# Altium project FelineFeast.PrjPcb (part 1 of 2)
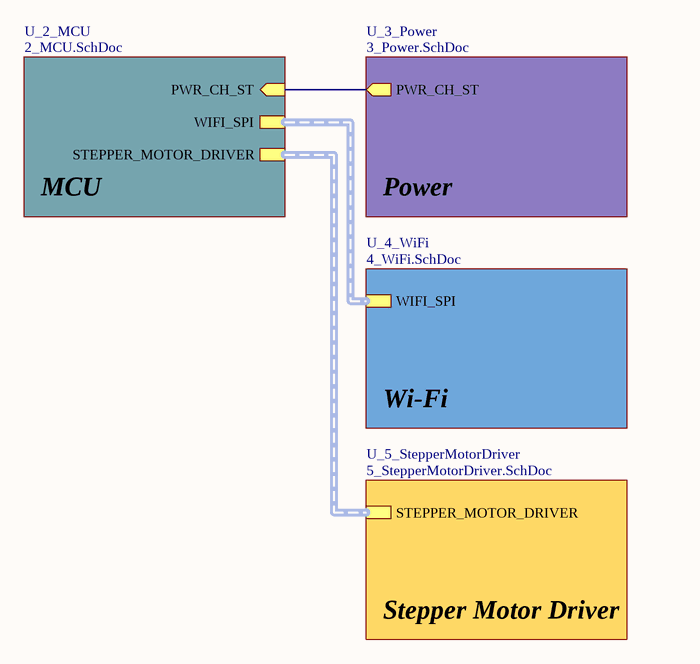
[diagram p0: 1_Overview.SchDoc]
5 sheets, 83 parts. Net scope: hierarchical (ports join the sheet entries above them; power ports are global).
Board file: FelineFeastPCB.PcbDoc
Sheets:
  1_Overview.SchDoc
    U_3_Power = 3_Power.SchDoc
    U_2_MCU = 2_MCU.SchDoc
    U_4_WiFi = 4_WiFi.SchDoc
    U_5_StepperMotorDriver = 5_StepperMotorDriver.SchDoc

## Sheet 1_Overview.SchDoc: Overview
size A4; DrawnBy: Denis Cooper; Organization: felinefeast.org; Revision: 1.0; SheetNumber: 1; SheetTotal: 5

### Sub-sheets
U_2_MCU = 2_MCU.SchDoc: WIFI_SPI (harness WIFI_SPI), PWR_CH_ST (in), STEPPER_MOTOR_DRIVER (harness STEPPER_MOTOR_DRIVER)
U_3_Power = 3_Power.SchDoc: PWR_CH_ST (out)
U_4_WiFi = 4_WiFi.SchDoc: WIFI_SPI (harness WIFI_SPI)
U_5_StepperMotorDriver = 5_StepperMotorDriver.SchDoc: STEPPER_MOTOR_DRIVER (harness STEPPER_MOTOR_DRIVER)

### Nets
NetIC200_18: sheet U_3_Power/PWR_CH_ST, sheet U_2_MCU/PWR_CH_ST

### Buses and harness runs
harness sheet U_2_MCU/STEPPER_MOTOR_DRIVER = sheet U_5_StepperMotorDriver/STEPPER_MOTOR_DRIVER
harness sheet U_2_MCU/WIFI_SPI = sheet U_4_WiFi/WIFI_SPI

### Notes on the sheet
- MCU
- Power
- Wi-Fi
- Stepper Motor Driver

## Sheet 3_Power.SchDoc: 24/5/3.3V Power
size A4; DrawnBy: Denis Cooper; Organization: felinefeast.org; Revision: 1.0; SheetNumber: 3; SheetTotal: 5
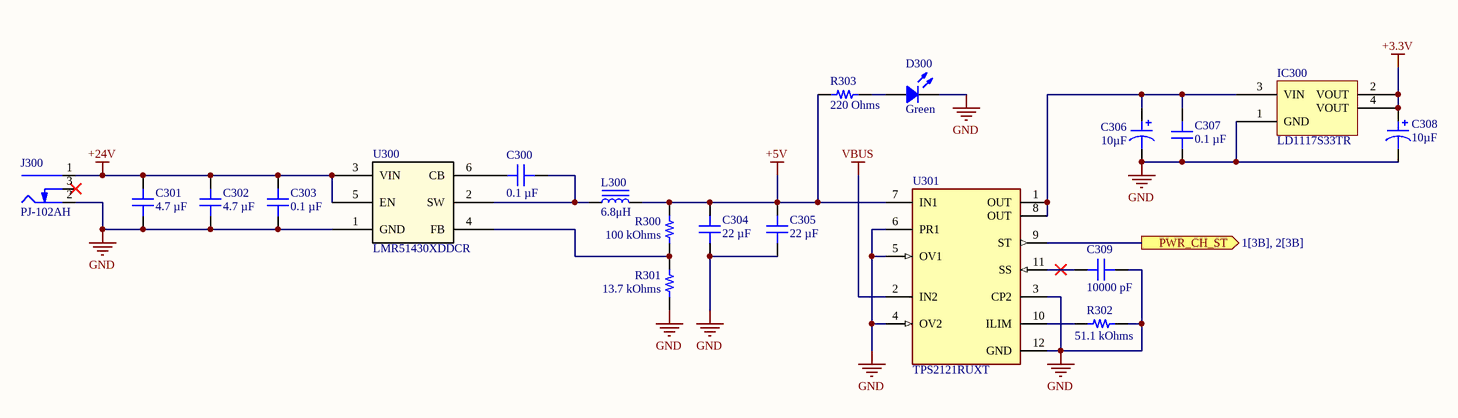
[diagram p1: 3_Power.SchDoc]

### Parts
C300  0.1 µF  [CAP 0603_1608]
C301  4.7 µF  [CAP 1206_3216 - 0.8MM]
C302  4.7 µF  [CAP 1206_3216 - 0.8MM]
C303  0.1 µF  [CAP 0603_1608]
C304  22 µF  [CAP 1210_3225 - 1MM]
C305  22 µF  [CAP 1210_3225 - 1MM]
C306  10µF  [CAP POL 1206_3216]
C307  0.1 µF  [CAP 0603_1608]
C308  10µF  [CAP POL 1206_3216]
C309  10000 pF  [CAP 0603_1608]
D300  Green  [LED 0603_1608 GREEN]
IC300  LD1117S33TR  [ST SOT-223]
J300  PJ-102AH  [CUI PJ-102AH]
L300  Inductance: 6.8μH  [SL0624-6R8M]  (hidden comment: SL0624-6R8M)
R300  100 kOhms  [RES 0603_1608]
R301  13.7 kOhms  [RES 0603_1608]
R302  51.1 kOhms  [RES 0603_1608]
R303  220 Ohms  [RES 0603_1608]
U300  LMR51430XDDCR  [SOT-23-THIN-6_DDC_TEX]
U301  TPS2121RUXT  [FP-RUX0012A-MFG]

### Ports
PWR_CH_ST (out, see 1[3B], 2[3B])

### Nets
+3.3V: C308.1 IC300.2(VOUT) IC300.4(VOUT)
+5V: C304.2 C305.2 L300.2 R300.2 R303.2 U301.7(IN1)
+24V: C301.2 C302.2 C303.2 J300.1(Centre) U300.3(VIN) U300.5(EN)
GND: C301.1 C302.1 C303.1 C304.1 C305.1 C306.2 C307.1 C308.2 C309.1 D300.2 IC300.1(GND) J300.2(Outer) R301.1 R302.1 U300.1(GND) U301.3(CP2) U301.4(OV2) U301.5(OV1) U301.6(PR1) U301.12(GND)
VBUS: U301.2(IN2)
NetC300_1: C300.1 L300.1 U300.2(SW)
NetC300_2: C300.2 U300.6(CB)
NetC306_1: C306.1 C307.2 IC300.3(VIN) U301.1(OUT) U301.8(OUT)
NetC309_2: C309.2 U301.11(SS)
NetD300_1: D300.1 R303.1
NetIC200_18: U301.9(ST) ; port PWR_CH_ST
NetR300_1: R300.1 R301.2 U300.4(FB)
NetR302_2: R302.2 U301.10(ILIM)

Not connected (* = marked no-connect by the designer): J300 3(SW)*

### Library data of the parts
C300 C307 = CL10B104KA8NNNC: CAP CER 0.1UF 25V X7R 0603; manufacturer: Samsung Electro-Mechanics; Tolerance: ±10%; Part Number: CL10B104KA8NNNC; Capacitance: 0.1 µF; Applications: General Purpose; componentlink1description: Datasheet; componentlink1url: http://www.samsungsem.com/kr/support/product-search/mlcc/CL10B104KA8NNNC.jsp; componentlink2description: DigiKey Link; componentlink2url: https://www.digikey.com/en/products/detail/samsung-electro-mechanics/CL10B104KA8NNNC/3886664; Device Package: 0603 (1608 Metric); lastupdated: 09.02.2024 20:10:20; Lifecycle Status: Active; Minimum Order: 1; Mounting Type: Surface Mount, MLCC; Operating Temperature: -55°C ~ 125°C; Package / Case: 0603 (1608 Metric); packaging: TapeAndReel; partid: 9793; Part Status: Active; price: 0.01; series: CL; Size / Dimension: 0.063" L x 0.031" W (1.60mm x 0.80mm); Supplier 1: DigiKey; Supplier Part Number 1: 1276-1006-1-ND; Temperature Coefficient: X7R; Thickness (Max): 0.035" (0.90mm); value: 0.1 µF; Voltage - Rated: 25V
C301 C302 = CL31B475KBHNNNE: CAP CER 4.7UF 50V X7R 1206; manufacturer: Samsung Electro-Mechanics; Tolerance: ±10%; Part Number: CL31B475KBHNNNE; Capacitance: 4.7 µF; Applications: General Purpose; componentlink1description: Datasheet; componentlink1url: http://www.samsungsem.com/kr/support/product-search/mlcc/CL31B475KBHNNNE.jsp; componentlink2description: DigiKey Link; componentlink2url: https://www.digikey.com/en/products/detail/samsung-electro-mechanics/CL31B475KBHNNNE/3888447; Device Package: 1206 (3216 Metric); lastupdated: 04.06.2024 19:10:40; Lifecycle Status: Active; Minimum Order: 1; Mounting Type: Surface Mount, MLCC; Operating Temperature: -55°C ~ 125°C; Package / Case: 1206 (3216 Metric); packaging: TapeAndReel; partid: 40975; Part Status: Active; price: 0.05; series: CL; Size / Dimension: 0.126" L x 0.063" W (3.20mm x 1.60mm); Supplier 1: DigiKey; Supplier Part Number 1: 1276-2789-1-ND; Temperature Coefficient: X7R; Thickness (Max): 0.071" (1.80mm); value: 4.7 µF; Voltage - Rated: 50V
C303 = CL10B104KB8NNNC: CAP CER 0.1UF 50V X7R 0603; manufacturer: Samsung Electro-Mechanics; Tolerance: ±10%; Part Number: CL10B104KB8NNNC; Capacitance: 0.1 µF; Applications: General Purpose; componentlink1description: Datasheet; componentlink1url: http://www.samsungsem.com/kr/support/product-search/mlcc/CL10B104KB8NNNC.jsp; componentlink2description: DigiKey Link; componentlink2url: https://www.digikey.com/en/products/detail/samsung-electro-mechanics/CL10B104KB8NNNC/3886658; Device Package: 0603 (1608 Metric); lastupdated: 09.02.2024 20:10:20; Lifecycle Status: Active; Minimum Order: 1; Mounting Type: Surface Mount, MLCC; Operating Temperature: -55°C ~ 125°C; Package / Case: 0603 (1608 Metric); packaging: TapeAndReel; partid: 9788; Part Status: Active; price: 0.01; series: CL; Size / Dimension: 0.063" L x 0.031" W (1.60mm x 0.80mm); Supplier 1: DigiKey; Supplier Part Number 1: 1276-1000-1-ND; Temperature Coefficient: X7R; Thickness (Max): 0.035" (0.90mm); value: 0.1 µF; Voltage - Rated: 50V
C304 C305 = CL32B226KAJNNNE: CAP CER 22UF 25V X7R 1210; manufacturer: Samsung Electro-Mechanics; Tolerance: ±10%; Part Number: CL32B226KAJNNNE; Value: 22 µF; Applications: General Purpose; Capacitance: 22 µF; componentlink1description: Datasheet; componentlink1url: http://www.samsungsem.com/kr/support/product-search/mlcc/CL32B226KAJNNNE.jsp; componentlink2description: DigiKey Link; componentlink2url: https://www.digikey.com/en/products/detail/samsung-electro-mechanics/CL32B226KAJNNNE/3889050; Device Package: 1210 (3225 Metric); lastupdated: 04.06.2024 19:21:03; Lifecycle Status: Active; Minimum Order: 1; Mounting Type: Surface Mount, MLCC; Operating Temperature: -55°C ~ 125°C; Package / Case: 1210 (3225 Metric); packaging: TapeAndReel; partid: 39957; Part Status: Active; price: 0.13; series: CL; Size / Dimension: 0.126" L x 0.098" W (3.20mm x 2.50mm); Supplier 1: DigiKey; Supplier Part Number 1: 1276-3392-1-ND; Temperature Coefficient: X7R; Thickness (Max): 0.106" (2.70mm); Voltage - Rated: 25V
C306 C308 = TAJA106K016RNJ: CAP TANT 10UF 10% 16V 1206; manufacturer: AVX Corporation; Manufacturer Size Code: A; ESR (Equivalent Series Resistance): 3Ohm; Type: Molded; Part Number: TAJA106K016RNJ; Value: 10µF; Capacitance: 10µF; componentlink1description: Datasheet; componentlink1url: http://datasheets.avx.com/TAJ.pdf; componentlink2description: DigiKey Link; componentlink2url: http://digikey.com/product-detail/en/avx-corporation/TAJA106K016RNJ/478-1655-1-ND/564687; Device Package: 1206 (3216 Metric); Features: General Purpose; Height - Seated (Max): 0.071" (1.80mm); lastupdated: 02.09.2020 1:15:58; Lifecycle Status: Active; Minimum Order: 1; Mounting Type: Surface Mount; Operating Temperature: -55°C ~ 125°C; Package / Case: 1206 (3216 Metric); packaging: TapeAndReel; partid: 412; Part Status: Active; price: 0.10; series: TAJ; Size / Dimension: 0.126" L x 0.063" W (3.20mm x 1.60mm); Supplier 1: DigiKey; Supplier Part Number 1: 478-1655-1-ND; Tolerance: ±10%; Voltage - Rated: 16V
C309 = CL10B103KB8NNNC: CAP CER 10000PF 50V X7R 0603; manufacturer: Samsung Electro-Mechanics; Tolerance: ±10%; Part Number: CL10B103KB8NNNC; Capacitance: 10000 pF; Applications: General Purpose; componentlink1description: Datasheet; componentlink1url: http://www.samsungsem.com/kr/support/product-search/mlcc/CL10B103KB8NNNC.jsp; componentlink2description: DigiKey Link; componentlink2url: https://www.digikey.com/en/products/detail/samsung-electro-mechanics/CL10B103KB8NNNC/3886667; Device Package: 0603 (1608 Metric); lastupdated: 09.02.2024 20:10:26; Lifecycle Status: Active; Minimum Order: 1; Mounting Type: Surface Mount, MLCC; Operating Temperature: -55°C ~ 125°C; Package / Case: 0603 (1608 Metric); packaging: TapeAndReel; partid: 5498; Part Status: Active; price: 0.01; series: CL; Size / Dimension: 0.063" L x 0.031" W (1.60mm x 0.80mm); Supplier 1: DigiKey; Supplier Part Number 1: 1276-1009-1-ND; Temperature Coefficient: X7R; Thickness (Max): 0.035" (0.90mm); value: 10000 pF; Voltage - Rated: 50V
D300 = APT1608CGCK: LED GREEN CLEAR CHIP SMD; Manufacturer: Kingbright; Configuration: Standard; Current - Test: 20mA; Lens Color: Colorless; Lens Size: 1.20mm x 0.80mm; Lens Style: Rectangle with Flat Top; Millicandela Rating: 50mcd; Viewing Angle: 120°; Voltage - Forward (Vf) (Typ): 2.1V; Wavelength - Dominant: 570nm; Wavelength - Peak: 574nm; Part Number: APT1608CGCK; Color: Green; ComponentLink1Description: Datasheet; ComponentLink1URL: http://www.kingbrightusa.com/images/catalog/SPEC/APT1608CGCK.pdf; ComponentLink2Description: DigiKey Link; ComponentLink2URL: https://www.digikey.com/en/products/detail/kingbright/APT1608CGCK/1747514; Device Package: 0603 (1608 Metric); Height (Max): 0.75mm; LastUpdated: 25.08.2025 20:35:24; Lens Transparency: Clear; Lifecycle Status: Active; Minimum Order: 1; Mounting Type: Surface Mount; Package / Case: 0603 (1608 Metric); Packaging: TapeAndReel; PartId: 664; Part Status: Active; Price: 0.05; Series: -; Size / Dimension: 1.60mm L x 0.80mm W; Supplier 1: DigiKey; Supplier Part Number 1: 754-1116-1-ND; Supplier Device Package: Chip LED; Value: Green
IC300 = LD1117S33TR: IC REG LINEAR 3.3V 800MA SOT223; Manufacturer: STMicroelectronics; Current - Quiescent (Iq): 10 mA; Number of Regulators: 1; Output Configuration: Positive; Output Type: Fixed; Protection Features: Over Current, Over Temperature; PSRR: 75dB (120Hz); Voltage Dropout (Max): 1.2V @ 800mA; Voltage - Input (Max): 15V; Part Number: LD1117S33TR; ComponentLink1Description: Datasheet; ComponentLink1URL: http://www.st.com/content/ccc/resource/technical/document/datasheet/99/3b/7d/91/91/51/4b/be/CD00000544.pdf/files/CD00000544.pdf/jcr:content/translations/en.CD00000544.pdf; ComponentLink2Description: DigiKey Link; ComponentLink2URL: https://www.digikey.com/en/products/detail/stmicroelectronics/LD1117S33TR/585766; Current - Output: 800mA; LastUpdated: 03.06.2024 20:14:20; Lifecycle Status: Active; Minimum Order: 1; Mounting Type: Surface Mount; Operating Temperature: 0°C ~ 125°C; Package / Case: TO-261-4, TO-261AA; Packaging: TapeAndReel; Part Status: Active; Price: 0.13; Series: -; Supplier 1: DigiKey; Supplier Part Number 1: 497-1242-1-ND; Supplier Device Package: SOT-223; Voltage - Output (Min/Fixed): 3.3V
J300 = PJ-102AH: CONN PWR JACK 2X5.5MM SOLDER; Manufacturer: CUI Devices; Actual Diameter: 0.079" (2.00mm ID), 0.256" (6.50mm OD); Current Rating (Amps): 5A; Gender: Male; Industry Recognized Mating Diameter: 2.00mm ID (0.079"), 5.50mm OD (0.217"); Internal Switch(s): Single Switch, Normally Closed; Material Flammability Rating: UL94 V-0; Mating Length/Depth: 0.354" (9.00mm); Number of Positions/Contacts: 2 Conductors, 3 Contacts; Shielding: Unshielded; Voltage - Rated: 24VDC; Part Number: PJ-102AH; ComponentLink1Description: Datasheet; ComponentLink1URL: https://www.cuidevices.com/product/resource/digikeypdf/pj-102ah.pdf; ComponentLink2Description: DigiKey Link; ComponentLink2URL: //digikey.com/product-detail/en/cui-devices/PJ-102AH/CP-102AH-ND/408448; Connector Type: Jack; LastUpdated: 16.12.2019 19:01:27; Lifecycle Status: 0; Minimum Order: 1; Mounting Type: Through Hole, Right Angle; Packaging: Tray; Part Status: Active; Price: 0.76; Series: -; Supplier 1: DigiKey; Supplier Part Number 1: CP-102AH-ND; Termination: Solder
L300 = SL0624-6R8M: 4A 5A 6.8uH 70mΩ ±20% SMD,7.1x6.6mm Inductors (SMD) ROHS; Manufacturer: TECHFUSE; Package: SMD,7.1x6.6mm; Current - Saturation (Isat): 5A; Tolerance: ±20%; Current Rating: 4A; DC Resistance (DCR): 70mΩ
R300 = ERJ-3EKF1003V: RES SMD 100K OHM 1% 1/10W 0603; Manufacturer: Panasonic Electronic Components; Power (Watts): 0.1W, 1/10W; Temperature Coefficient: ±100ppm/°C; Part Number: ERJ-3EKF1003V; Value: 100 kOhms; ComponentLink1Description: Datasheet; ComponentLink1URL: https://industrial.panasonic.com/cdbs/www-data/pdf/RDA0000/AOA0000C304.pdf; ComponentLink2Description: DigiKey Link; ComponentLink2URL: https://www.digikey.com/en/products/detail/panasonic-electronic-components/ERJ-3EKF1003V/196075; Composition: Thick Film; Device Package: 0603 (1608 Metric); Features: Automotive AEC-Q200; Height - Seated (Max): 0.022" (0.55mm); LastUpdated: 09.02.2024 20:41:59; Lifecycle Status: Active; Minimum Order: 1; Number of Terminations: 2; Operating Temperature: -55°C ~ 155°C; Package / Case: 0603 (1608 Metric); Packaging: TapeAndReel; PartId: 25699; Part Status: Active; Price: 0.01; Ratings: AEC-Q200; Resistance: 100 kOhms; Series: ERJ-3EK; Size / Dimension: 0.063" L x 0.031" W (1.60mm x 0.80mm); Supplier 1: DigiKey; Supplier Part Number 1: P100KHCT-ND; Supplier Device Package: 0603; Tolerance: ±1%
R301 = ERJ-3EKF1372V: RES SMD 13.7K OHM 1% 1/10W 0603; Manufacturer: Panasonic Electronic Components; Power (Watts): 0.1W, 1/10W; Temperature Coefficient: ±100ppm/°C; Part Number: ERJ-3EKF1372V; Value: 13.7 kOhms; ComponentLink1Description: Datasheet; ComponentLink1URL: https://industrial.panasonic.com/cdbs/www-data/pdf/RDA0000/AOA0000C304.pdf; ComponentLink2Description: DigiKey Link; ComponentLink2URL: https://www.digikey.com/en/products/detail/panasonic-electronic-components/ERJ-3EKF1372V/196114; Composition: Thick Film; Device Package: 0603 (1608 Metric); Features: Automotive AEC-Q200; Height - Seated (Max): 0.022" (0.55mm); LastUpdated: 09.02.2024 20:41:57; Lifecycle Status: Active; Minimum Order: 1; Number of Terminations: 2; Operating Temperature: -55°C ~ 155°C; Package / Case: 0603 (1608 Metric); Packaging: TapeAndReel; PartId: 26000; Part Status: Active; Price: 0.01; Ratings: AEC-Q200; Resistance: 13.7 kOhms; Series: ERJ-3EK; Size / Dimension: 0.063" L x 0.031" W (1.60mm x 0.80mm); Supplier 1: DigiKey; Supplier Part Number 1: P13.7KHCT-ND; Supplier Device Package: 0603; Tolerance: ±1%
R302 = ERA-3AEB5112V: RES SMD 51.1KOHM 0.1% 1/10W 0603; Manufacturer: Panasonic Electronic Components; Power (Watts): 0.1W, 1/10W; Temperature Coefficient: ±25ppm/°C; Part Number: ERA-3AEB5112V; Value: 51.1 kOhms; ComponentLink1Description: Datasheet; ComponentLink1URL: https://industrial.panasonic.com/cdbs/www-data/pdf/RDM0000/AOA0000C307.pdf; ComponentLink2Description: DigiKey Link; ComponentLink2URL: https://www.digikey.com/en/products/detail/panasonic-electronic-components/ERA-3AEB5112V/2026902; Composition: Thin Film; Device Package: 0603 (1608 Metric); Features: Automotive AEC-Q200; Height - Seated (Max): 0.022" (0.55mm); LastUpdated: 09.02.2024 20:42:09; Lifecycle Status: Active; Minimum Order: 1; Number of Terminations: 2; Operating Temperature: -55°C ~ 155°C; Package / Case: 0603 (1608 Metric); Packaging: TapeAndReel; PartId: 24671; Part Status: Active; Price: 0.03; Ratings: AEC-Q200; Resistance: 51.1 kOhms; Series: ERA-3A; Size / Dimension: 0.063" L x 0.031" W (1.60mm x 0.80mm); Supplier 1: DigiKey; Supplier Part Number 1: P51.1KDBCT-ND; Supplier Device Package: 0603; Tolerance: ±0.1%
R303 = ERJ-P03F2200V: RES SMD 220 OHM 1% 1/5W 0603; Manufacturer: Panasonic Electronic Components; Power (Watts): 0.2W, 1/5W; Temperature Coefficient: ±200ppm/°C; Part Number: ERJ-P03F2200V; Value: 220 Ohms; ComponentLink1Description: Datasheet; ComponentLink1URL: https://industrial.panasonic.com/cdbs/www-data/pdf/RDO0000/AOA0000C331.pdf; ComponentLink2Description: DigiKey Link; ComponentLink2URL: https://www.digikey.com/en/products/detail/panasonic-electronic-components/ERJ-P03F2200V/9810390; Composition: Thick Film; Device Package: 0603 (1608 Metric); Features: Automotive AEC-Q200, Pulse Withstanding; Height - Seated (Max): 0.022" (0.55mm); LastUpdated: 09.02.2024 20:40:33; Lifecycle Status: Active; Minimum Order: 1; Number of Terminations: 2; Operating Temperature: -55°C ~ 155°C; Package / Case: 0603 (1608 Metric); Packaging: TapeAndReel; PartId: 82268; Price: 0.03; Ratings: AEC-Q200; Resistance: 220 Ohms; Series: ERJ-P03; Size / Dimension: 0.063" L x 0.031" W (1.60mm x 0.80mm); Supplier 1: DigiKey; Supplier Part Number 1: 10-ERJ-P03F2200VCT-ND; Supplier Device Package: 0603; Tolerance: ±1%
U300 = LMR51430XDDCR: SIMPLE SWITCHER&reg; 4.5-V to 36-V, 3-A synchronous buck converter with 40-&micro;A IQ 6-SOT-23-THIN -40 to 150; Manufacturer_Name: Texas Instruments; Copyright: Copyright (C) 2026 Ultra Librarian. All rights reserved.; Manufacturer_Part_Number: LMR51430XDDCR; RefDes: RefDes; Type: Type
U301 = CMP-04910-000091-1: PWR MGMT BATTERY MGMT

## Sheet 2_MCU.SchDoc: Microcontroller
size A4; DrawnBy: Denis Cooper; Organization: felinefeast.org; Revision: 1.0; SheetNumber: 2; SheetTotal: 5
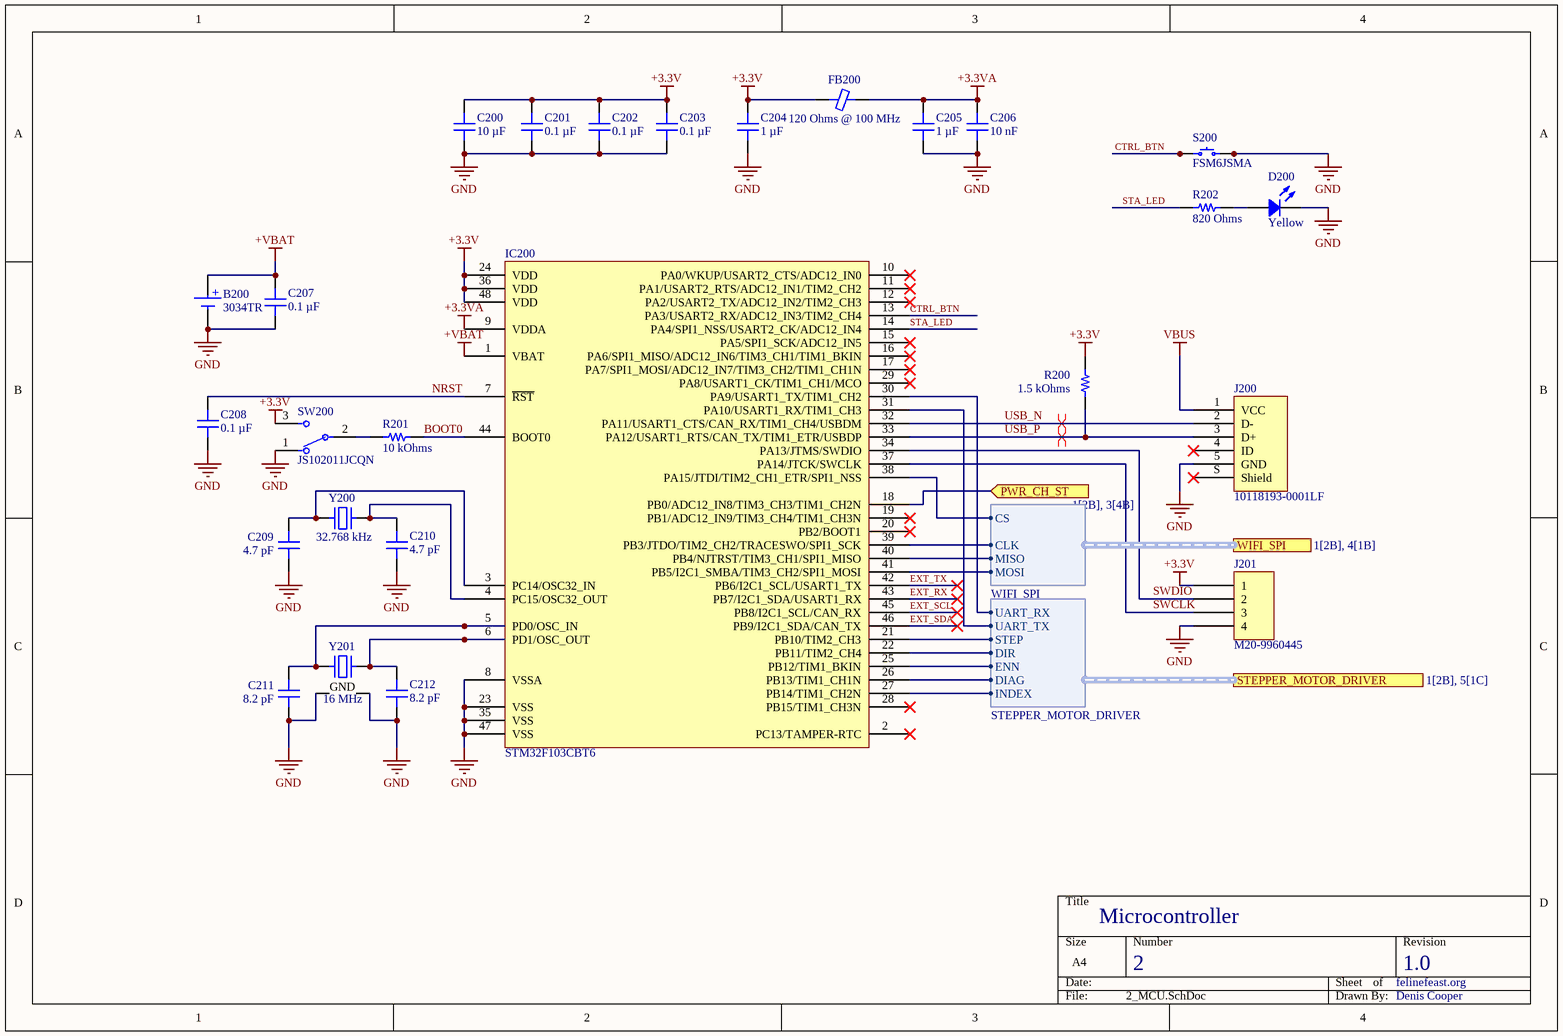
[diagram p2: 2_MCU.SchDoc]

### Parts
B200  3034TR  [KEYSTONE 3034TR]
C200  10 µF  [CAP 0805_2012]
C201  0.1 µF  [CAP 0603_1608]
C202  0.1 µF  [CAP 0603_1608]
C203  0.1 µF  [CAP 0603_1608]
C204  1 µF  [CAP 0805_2012]
C205  1 µF  [CAP 0805_2012]
C206  Capacitance: 10 nF  [CAP 0603_1608]  (hidden comment: 10000 pF)
C207  0.1 µF  [CAP 0603_1608]
C208  0.1 µF  [CAP 0603_1608]
C209  4.7 pF  [MURATA GJM155 0402_1005]
C210  4.7 pF  [MURATA GJM155 0402_1005]
C211  8.2 pF  [CAP 0603_1608]
C212  8.2 pF  [CAP 0603_1608]
D200  Yellow  [LED 0603_1608 YELLOW]
FB200  120 Ohms @ 100 MHz  [FER 0603_1608]
IC200  STM32F103CBT6  [ST LQFP-48 7X7MM]
J200  10118193-0001LF  [FCI USB 10118193-0001LF]
J201  M20-9960445  [HARWIN M20-9960445]
R200  1.5 kOhms  [RES 0603_1608]
R201  10 kOhms  [RES 0603_1608]
R202  820 Ohms  [RES 0603_1608]
S200  FSM6JSMA  [TE FSM6JSMA]
SW200  JS102011JCQN  [FP-JS102011JCQN-MFG]
Y200  32.768 kHz  [ABRACON ABS07]
Y201  16 MHz  [NDK NX3225GA]

### Ports
PWR_CH_ST (in, see 1[2B], 3[4B]), STEPPER_MOTOR_DRIVER (harness STEPPER_MOTOR_DRIVER, see 1[2B], 5[1C]), WIFI_SPI (harness WIFI_SPI, see 1[2B], 4[1B])

### Harnesses
WIFI_SPI: CLK, CS, MOSI, MISO
STEPPER_MOTOR_DRIVER: STEP, DIR, UART_TX, ENN, INDEX, DIAG, UART_RX

### Nets
+3.3V: C200.1 C201.2 C202.2 C203.2 C204.2 FB200.1 IC200.24(VDD) IC200.36(VDD) IC200.48(VDD) J201.1 R200.2 SW200.3
+3.3VA: C205.2 C206.2 FB200.2 IC200.9(VDDA)
+VBAT: B200.1(+) C207.2 IC200.1(VBAT)
GND: B200.2(-) C200.2 C201.1 C202.1 C203.1 C204.1 C205.1 C206.1 C207.1 C208.2 C209.1 C210.1 C211.2 C212.2 D200.2 IC200.8(VSSA) IC200.23(VSS) IC200.35(VSS) IC200.47(VSS) J200.5(GND) J201.4 S200.3 S200.4 SW200.1 Y201.2(GND) Y201.4(GND)
VBUS: J200.1(VCC)
BOOT0: IC200.44(BOOT0) R201.2
CLK: IC200.39(PB3/JTDO/TIM2_CH2/TRACESWO/SPI1_SCK) ; port WIFI_SPI.CLK
CS: IC200.38(PA15/JTDI/TIM2_CH1_ETR/SPI1_NSS) ; port WIFI_SPI.CS
CTRL_BTN: IC200.13(PA3/USART2_RX/ADC12_IN3/TIM2_CH4) S200.1 S200.2
DIAG: IC200.26(PB13/TIM1_CH1N) ; port STEPPER_MOTOR_DRIVER.DIAG
DIR: IC200.22(PB11/TIM2_CH4) ; port STEPPER_MOTOR_DRIVER.DIR
ENN: IC200.25(PB12/TIM1_BKIN) ; port STEPPER_MOTOR_DRIVER.ENN
EXT_RX: IC200.43(PB7/I2C1_SDA/USART1_RX)
EXT_SCL: IC200.45(PB8/I2C1_SCL/CAN_RX)
EXT_SDA: IC200.46(PB9/I2C1_SDA/CAN_TX)
EXT_TX: IC200.42(PB6/I2C1_SCL/USART1_TX)
INDEX: IC200.27(PB14/TIM1_CH2N) ; port STEPPER_MOTOR_DRIVER.INDEX
MISO: IC200.40(PB4/NJTRST/TIM3_CH1/SPI1_MISO) ; port WIFI_SPI.MISO
MOSI: IC200.41(PB5/I2C1_SMBA/TIM3_CH2/SPI1_MOSI) ; port WIFI_SPI.MOSI
NRST: C208.1 IC200.7(~{RST})
STA_LED: IC200.14(PA4/SPI1_NSS/USART2_CK/ADC12_IN4) R202.2
STEP: IC200.21(PB10/TIM2_CH3) ; port STEPPER_MOTOR_DRIVER.STEP
SWCLK: IC200.37(PA14/JTCK/SWCLK) J201.3
SWDIO: IC200.34(PA13/JTMS/SWDIO) J201.2
UART_RX: IC200.30(PA9/USART1_TX/TIM1_CH2) ; port STEPPER_MOTOR_DRIVER.UART_RX
UART_TX: IC200.31(PA10/USART1_RX/TIM1_CH3) ; port STEPPER_MOTOR_DRIVER.UART_TX
USB_N: IC200.32(PA11/USART1_CTS/CAN_RX/TIM1_CH4/USBDM) J200.2(D-)
USB_P: IC200.33(PA12/USART1_RTS/CAN_TX/TIM1_ETR/USBDP) J200.3(D+) R200.1
NetC209_2: C209.2 IC200.3(PC14/OSC32_IN) Y200.1
NetC210_2: C210.2 IC200.4(PC15/OSC32_OUT) Y200.2
NetC211_1: C211.1 IC200.5(PD0/OSC_IN) Y201.1
NetC212_1: C212.1 IC200.6(PD1/OSC_OUT) Y201.3
NetD200_1: D200.1 R202.1
NetIC200_18: IC200.18(PB0/ADC12_IN8/TIM3_CH3/TIM1_CH2N) ; port PWR_CH_ST
NetR201_1: R201.1 SW200.2

Not connected (* = marked no-connect by the designer): IC200 2(PC13/TAMPER-RTC)* 10(PA0/WKUP/USART2_CTS/ADC12_IN0)* 11(PA1/USART2_RTS/ADC12_IN1/TIM2_CH2)* 12(PA2/USART2_TX/ADC12_IN2/TIM2_CH3)* 15(PA5/SPI1_SCK/ADC12_IN5)* 16(PA6/SPI1_MISO/ADC12_IN6/TIM3_CH1/TIM1_BKIN)* 17(PA7/SPI1_MOSI/ADC12_IN7/TIM3_CH2/TIM1_CH1N)* 19(PB1/ADC12_IN9/TIM3_CH4/TIM1_CH3N)* 20(PB2/BOOT1)* 28(PB15/TIM1_CH3N)* 29(PA8/USART1_CK/TIM1_CH1/MCO)*; J200 4(ID)* S(Shield)*

### Layout directives
differential pair: USB_N, USB_P

### Library data of the parts
B200 = 3034TR: BATTERY RETAINER COIN 20MM SMD; Manufacturer: Keystone Electronics; Battery Cell Size: Coin, 20.0mm; Battery Series: 2020, 2025, 2032; Battery Type, Function: Coin Cell, Retainer; Number of Cells: 1; Part Number: 3034TR; ComponentLink1Description: Datasheet; ComponentLink1URL: http://keyelco.com/userAssets/file/M65p9.pdf; ComponentLink2Description: DigiKey Link; ComponentLink2URL: https://www.digikey.com/en/products/detail/keystone-electronics/3034TR/4499408; Height Above Board: 0.160" (4.06mm); LastUpdated: 29.08.2025 3:23:39; Lifecycle Status: Active; Minimum Order: 1; Mounting Type: PCB, Surface Mount; Packaging: TapeAndReel; PartId: 8; Part Status: Active; Price: 0.20; Series: -; Style: Retainer; Supplier 1: DigiKey; Supplier Part Number 1: 36-3034CT-ND; Termination Style: SMD (SMT) Tab
C200 = CL21B106KPQNNNE: CAP CER 10UF 10V X7R 0805; manufacturer: Samsung Electro-Mechanics; Tolerance: ±10%; Part Number: CL21B106KPQNNNE; Capacitance: 10 µF; Applications: General Purpose; componentlink1description: Datasheet; componentlink1url: http://www.samsungsem.com/kr/support/product-search/mlcc/CL21B106KPQNNNE.jsp; componentlink2description: DigiKey Link; componentlink2url: https://www.digikey.com/en/products/detail/samsung-electro-mechanics/CL21B106KPQNNNE/3887422; Device Package: 0805 (2012 Metric); lastupdated: 09.02.2024 20:15:41; Lifecycle Status: Active; Minimum Order: 1; Mounting Type: Surface Mount, MLCC; Operating Temperature: -55°C ~ 125°C; Package / Case: 0805 (2012 Metric); packaging: TapeAndReel; partid: 13130; Part Status: Active; price: 0.02; series: CL; Size / Dimension: 0.079" L x 0.049" W (2.00mm x 1.25mm); Supplier 1: DigiKey; Supplier Part Number 1: 1276-1764-1-ND; Temperature Coefficient: X7R; Thickness (Max): 0.055" (1.40mm); value: 10 µF; Voltage - Rated: 10V
C201-C203 C207 C208 = CL10B104KA8NNNC: as C300 on sheet 3_Power; Part Number: CL10B104KA8NNNC; Capacitance: 0.1 µF; Applications: General Purpose; componentlink1description: Datasheet; componentlink1url: http://www.samsungsem.com/kr/support/product-search/mlcc/CL10B104KA8NNNC.jsp; componentlink2description: DigiKey Link; componentlink2url: https://www.digikey.com/en/products/detail/samsung-electro-mechanics/CL10B104KA8NNNC/3886664; Device Package: 0603 (1608 Metric); lastupdated: 09.02.2024 20:10:20; Lifecycle Status: Active; Minimum Order: 1; Mounting Type: Surface Mount, MLCC; Operating Temperature: -55°C ~ 125°C; Package / Case: 0603 (1608 Metric); packaging: TapeAndReel; partid: 9793; Part Status: Active; price: 0.01; series: CL; Size / Dimension: 0.063" L x 0.031" W (1.60mm x 0.80mm); Supplier 1: DigiKey; Supplier Part Number 1: 1276-1006-1-ND; Temperature Coefficient: X7R; Thickness (Max): 0.035" (0.90mm); value: 0.1 µF; Voltage - Rated: 25V
C204 C205 = CL21B105KAFNFNE: CAP CER 1UF 25V X7R 0805; manufacturer: Samsung Electro-Mechanics; Tolerance: ±10%; Part Number: CL21B105KAFNFNE; Capacitance: 1 µF; Applications: General Purpose; componentlink1description: Datasheet; componentlink1url: http://www.samsungsem.com/kr/support/product-search/mlcc/CL21B105KAFNFNE.jsp; componentlink2description: DigiKey Link; componentlink2url: https://www.digikey.com/en/products/detail/samsung-electro-mechanics/CL21B105KAFNFNE/3888584; Device Package: 0805 (2012 Metric); lastupdated: 09.02.2024 20:16:02; Lifecycle Status: Active; Minimum Order: 1; Mounting Type: Surface Mount, MLCC; Operating Temperature: -55°C ~ 125°C; Package / Case: 0805 (2012 Metric); packaging: TapeAndReel; partid: 4875; Part Status: Active; price: 0.01; series: CL; Size / Dimension: 0.079" L x 0.049" W (2.00mm x 1.25mm); Supplier 1: DigiKey; Supplier Part Number 1: 1276-2926-1-ND; Temperature Coefficient: X7R; Thickness (Max): 0.053" (1.35mm); value: 1 µF; Voltage - Rated: 25V
C206 = CL10B103KB8NNNC: as C309 on sheet 3_Power; Part Number: CL10B103KB8NNNC; Applications: General Purpose; componentlink1description: Datasheet; componentlink1url: http://www.samsungsem.com/kr/support/product-search/mlcc/CL10B103KB8NNNC.jsp; componentlink2description: DigiKey Link; componentlink2url: https://www.digikey.com/en/products/detail/samsung-electro-mechanics/CL10B103KB8NNNC/3886667; Device Package: 0603 (1608 Metric); lastupdated: 09.02.2024 20:10:26; Lifecycle Status: Active; Minimum Order: 1; Mounting Type: Surface Mount, MLCC; Operating Temperature: -55°C ~ 125°C; Package / Case: 0603 (1608 Metric); packaging: TapeAndReel; partid: 5498; Part Status: Active; price: 0.01; series: CL; Size / Dimension: 0.063" L x 0.031" W (1.60mm x 0.80mm); Supplier 1: DigiKey; Supplier Part Number 1: 1276-1009-1-ND; Temperature Coefficient: X7R; Thickness (Max): 0.035" (0.90mm); value: 10000 pF; Voltage - Rated: 50V
C209 C210 = GJM1555C1H4R7GB01D: CAP CER 4.7PF 50V C0G/NP0 0402; manufacturer: Murata Electronics; Temperature Coefficient: C0G, NP0; Tolerance: ±2%; Part Number: GJM1555C1H4R7GB01D; Capacitance: 4.7 pF; Applications: RF, Microwave, High Frequency; componentlink1description: Datasheet; componentlink1url: https://search.murata.co.jp/Ceramy/image/img/A01X/G101/ENG/GJM1555C1H4R7GB01-01A.pdf; componentlink2description: DigiKey Link; componentlink2url: https://www.digikey.com/en/products/detail/murata-electronics/GJM1555C1H4R7GB01D/16033620; Device Package: 0402 (1005 Metric); Features: High Q, Low Loss; lastupdated: 20.07.2024 0:08:42; Lifecycle Status: Active; Minimum Order: 1; Mounting Type: Surface Mount, MLCC; Operating Temperature: -55°C ~ 125°C; Package / Case: 0402 (1005 Metric); packaging: TapeAndReel; partid: 55648; price: 0.01; series: GJM; Size / Dimension: 0.039" L x 0.020" W (1.00mm x 0.50mm); Supplier 1: DigiKey; Supplier Part Number 1: 490-GJM1555C1H4R7GB01DCT-ND; Thickness (Max): 0.022" (0.55mm); value: 4.7 pF; Voltage - Rated: 50V
C211 C212 = CC0603JRNPO9BN8R2: CAP CER 8.2PF 50V C0G/NPO 0603; manufacturer: Yageo; Temperature Coefficient: C0G, NP0; Tolerance: ±5%; Part Number: CC0603JRNPO9BN8R2; Capacitance: 8.2 pF; Applications: General Purpose; componentlink1description: Datasheet; componentlink1url: https://www.yageo.com/upload/media/product/productsearch/datasheet/mlcc/UPY-GP_NP0_16V-to-50V_17.pdf; componentlink2description: DigiKey Link; componentlink2url: https://www.digikey.com/en/products/detail/yageo/CC0603JRNPO9BN8R2/5883626; Device Package: 0603 (1608 Metric); lastupdated: 09.02.2024 20:10:11; Lifecycle Status: Active; Minimum Order: 1; Mounting Type: Surface Mount, MLCC; Operating Temperature: -55°C ~ 125°C; Package / Case: 0603 (1608 Metric); packaging: TapeAndReel; partid: 15511; Part Status: Active; price: 0.01; series: CC; Size / Dimension: 0.063" L x 0.031" W (1.60mm x 0.80mm); Supplier 1: DigiKey; Supplier Part Number 1: 311-3977-1-ND; Thickness (Max): 0.035" (0.90mm); value: 8.2 pF; Voltage - Rated: 50V
D200 = LY L29K-H1K2-26-Z: LED YELLOW DIFFUSED 0603 SMD; Manufacturer: OSRAM Opto Semiconductors Inc.; Configuration: Standard; Current - Test: 2mA; Lens Color: White; Lens Size: 1.30mm x 0.80mm; Lens Style: Rectangle with Flat Top; Millicandela Rating: 7mcd; Viewing Angle: 160°; Voltage - Forward (Vf) (Typ): 1.8V; Wavelength - Dominant: 587nm; Wavelength - Peak: 591nm; Part Number: LY L29K-H1K2-26-Z; Color: Yellow; ComponentLink1Description: Datasheet; ComponentLink1URL: https://dammedia.osram.info/media/resource/hires/osram-dam-2492957/LY%20L29K.pdf; ComponentLink2Description: DigiKey Link; ComponentLink2URL: https://www.digikey.com/en/products/detail/osram-opto-semiconductors-inc/LY-L29K-H1K2-26-Z/810340; Device Package: 0603 (1608 Metric); Height (Max): 0.65mm; LastUpdated: 03.06.2024 20:01:09; Lens Transparency: Diffused; Lifecycle Status: Active; Minimum Order: 1; Mounting Type: Surface Mount; Package / Case: 0603 (1608 Metric); Packaging: TapeAndReel; PartId: 140; Part Status: Active; Price: 0.07; Series: SMARTLED® 0603; Size / Dimension: 1.70mm L x 0.80mm W; Supplier 1: DigiKey; Supplier Part Number 1: 475-1196-1-ND; Supplier Device Package: 0603; Value: Yellow
FB200 = GZ1608D121TF: FERRITE BEAD 120 OHM 0603 1LN; Manufacturer: Shenzhen Sunlord Electronics Co., Ltd.; Current Rating (Max): 300mA; DC Resistance (DCR) (Max): 200mOhm; Filter Type: Signal Line; Number of Lines: 1; Part Number: GZ1608D121TF; ComponentLink1Description: Datasheet; ComponentLink1URL: https://www.sunlordinc.com/Download.aspx?file=L1VwbG9hZEZpbGVzL1BERl9DYXQvMjAxOTA0MDgxMzU0MTk3NjMucGRm&lan=en; ComponentLink2Description: DigiKey Link; ComponentLink2URL: https://www.digikey.com/en/products/detail/shenzhen-sunlord-electronics-co-ltd/GZ1608D121TF/14120576; Device Package: 0603 (1608 Metric); Height (Max): 0.037" (0.95mm); Impedance @ Frequency: 120 Ohms @ 100 MHz; LastUpdated: 03.06.2024 19:51:45; Lifecycle Status: Active; Minimum Order: 1; Mounting Type: Surface Mount; Operating Temperature: -55°C ~ 125°C; Package / Case: 0603 (1608 Metric); Packaging: TapeAndReel; PartId: 2588; Part Status: Active; Price: 0.01; Series: GZ; Size / Dimension: 0.063" L x 0.031" W (1.60mm x 0.80mm); Supplier 1: DigiKey; Supplier Part Number 1: 3442-GZ1608D121TFCT-ND; Value: 120 Ohms @ 100 MHz
IC200 = STM32F103CBT6: IC MCU 32BIT 128KB FLASH 48LQFP; Manufacturer: STMicroelectronics; Connectivity: CANbus, I²C, IrDA, LINbus, SPI, UART/USART, USB; Core Processor: ARM® Cortex®-M3; Core Size: 32-Bit; Data Converters: A/D 10x12b; Number of I/O: 37; Oscillator Type: Internal; Peripherals: DMA, Motor Control PWM, PDR, POR, PVD, PWM, Temp Sensor, WDT; Program Memory Size: 128KB (128K x 8); RAM Size: 20K x 8; Speed: 72MHz; Voltage - Supply (Vcc/Vdd): 2V ~ 3.6V; Part Number: STM32F103CBT6; ComponentLink1Description: Datasheet; ComponentLink1URL: https://www.st.com/resource/en/datasheet/stm32f103cb.pdf; ComponentLink2Description: DigiKey Link; ComponentLink2URL: http://digikey.com/product-detail/en/stmicroelectronics/STM32F103CBT6/497-6288-ND/1754420; Device Package: 48-LQFP; LastUpdated: 24.05.2020 22:49:18; Lifecycle Status: Active; Minimum Order: 1; Mounting Type: Surface Mount; Operating Temperature: -40°C ~ 85°C (TA); Package / Case: 48-LQFP; Packaging: Tray; PartId: 194; Part Status: Active; Price: 5.25; Program Memory Type: FLASH; Series: STM32F1; Supplier 1: DigiKey; Supplier Part Number 1: 497-6288-ND
J200 = 10118193-0001LF: CONN RCPT USB2.0 MICRO B SMD R/A; Manufacturer: Amphenol ICC (FCI); Connector Type: USB - micro B; Current Rating (Amps): 1.8A per Contact; Gender: Receptacle; Mating Cycles: 10000; Number of Contacts: 5; Number of Ports: 1; Shielding: Shielded; Voltage - Rated: 100VAC; Part Number: 10118193-0001LF; ComponentLink1Description: Datasheet; ComponentLink1URL: https://cdn.amphenol-icc.com/media/wysiwyg/files/documentation/datasheet/inputoutput/io_usb_micro.pdf; ComponentLink2Description: DigiKey Link; ComponentLink2URL: //digikey.com/product-detail/en/amphenol-icc-fci/10118193-0001LF/609-4616-2-ND/2785388; Features: Solder Retention; LastUpdated: 09.12.2019 20:51:28; Lifecycle Status: 0; Minimum Order: 1; Mounting Feature: Horizontal; Mounting Type: Surface Mount, Right Angle; Through Hole; Operating Temperature: -30°C ~ 80°C; Packaging: TapeAndReel; Part Status: Active; Price: 0.21; Series: -; Specifications: USB 2.0; Supplier 1: DigiKey; Supplier Part Number 1: 609-4616-2-ND; Termination: Solder
J201 = M20-9960445: CONN HEADER R/A 4POS 2.54MM; Manufacturer: Harwin Inc.; Connector Type: Header, Cuttable; Contact Length - Mating: 0.240" (6.10mm); Contact Length - Post: 0.118" (3.00mm); Current Rating (Amps): 3A per Contact; Material Flammability Rating: UL94 V-0; Number of Positions: 4; Number of Positions Loaded: All; Pitch - Mating: 0.100" (2.54mm); Row Spacing - Mating: -40°C ~ 105°C; Shrouding: Unshrouded; Style: Board to Board or Cable; Part Number: M20-9960445; ComponentLink1Description: Datasheet; ComponentLink1URL: https://cdn.harwin.com/pdfs/Harwin_PC_Connectors_M20.pdf; ComponentLink2Description: DigiKey Link; ComponentLink2URL: https://www.digikey.com/en/products/detail/harwin-inc/M20-9960445/3921052; Contact Finish - Mating: Gold; Contact Material: Brass; Contact Shape: Square; Contact Type: Male Pin; Fastening Type: Push-Pull; Insulation Color: Black; Insulation Height: 0.100" (2.54mm); Insulation Material: Polyamide (PA6T), Nylon 6T; LastUpdated: 21.09.2022 19:23:20; Lifecycle Status: Active; Minimum Order: 1; Mounting Type: Through Hole, Right Angle; Number of Rows: 1; Operating Temperature: -40°C ~ 105°C; Packaging: Bulk; PartId: 167; Part Status: Active; Price: 0.11; Series: M20; Supplier 1: DigiKey; Supplier Part Number 1: 952-3286-ND; Termination: Solder
R200 = ERJ-3GEYJ152V: RES SMD 1.5K OHM 5% 1/10W 0603; Manufacturer: Panasonic Electronic Components; Power (Watts): 0.1W, 1/10W; Temperature Coefficient: ±200ppm/°C; Part Number: ERJ-3GEYJ152V; Value: 1.5 kOhms; ComponentLink1Description: Datasheet; ComponentLink1URL: http://industrial.panasonic.com/www-cgi/jvcr13pz.cgi?E+PZ+3+AOA0001+ERJ3GEYJ152V+7+WW; ComponentLink2Description: DigiKey Link; ComponentLink2URL: https://www.digikey.com/en/products/detail/panasonic-electronic-components/ERJ-3GEYJ152V/104381; Composition: Thick Film; Device Package: 0603 (1608 Metric); Features: Automotive AEC-Q200; Height - Seated (Max): 0.022" (0.55mm); LastUpdated: 09.02.2024 20:42:41; Lifecycle Status: Active; Minimum Order: 1; Number of Terminations: 2; Operating Temperature: -55°C ~ 155°C; Package / Case: 0603 (1608 Metric); Packaging: TapeAndReel; PartId: 19210; Part Status: Active; Price: 0.01; Ratings: AEC-Q200; Resistance: 1.5 kOhms; Series: ERJ-3G; Size / Dimension: 0.063" L x 0.031" W (1.60mm x 0.80mm); Supplier 1: DigiKey; Supplier Part Number 1: P1.5KGCT-ND; Supplier Device Package: 0603; Tolerance: ±5%
R201 = ERJ-P03F1002V: RES SMD 10 KOHM 1% 1/5W 0603; Manufacturer: Panasonic Electronic Components; Power (Watts): 0.2W, 1/5W; Temperature Coefficient: ±200ppm/°C; Part Number: ERJ-P03F1002V; Value: 10 kOhms; ComponentLink1Description: Datasheet; ComponentLink1URL: https://industrial.panasonic.com/cdbs/www-data/pdf/RDO0000/AOA0000C331.pdf; ComponentLink2Description: DigiKey Link; ComponentLink2URL: https://www.digikey.com/en/products/detail/panasonic-electronic-components/ERJ-P03F1002V/9810215; Composition: Thick Film; Device Package: 0603 (1608 Metric); Features: Automotive AEC-Q200, Pulse Withstanding; Height - Seated (Max): 0.022" (0.55mm); LastUpdated: 09.02.2024 20:40:33; Lifecycle Status: Active; Minimum Order: 1; Number of Terminations: 2; Operating Temperature: -55°C ~ 155°C; Package / Case: 0603 (1608 Metric); Packaging: TapeAndReel; PartId: 82212; Price: 0.03; Ratings: AEC-Q200; Resistance: 10 kOhms; Series: ERJ-P03; Size / Dimension: 0.063" L x 0.031" W (1.60mm x 0.80mm); Supplier 1: DigiKey; Supplier Part Number 1: 10-ERJ-P03F1002VCT-ND; Supplier Device Package: 0603; Tolerance: ±1%
R202 = ERJ-3EKF8200V: RES SMD 820 OHM 1% 1/10W 0603; Manufacturer: Panasonic Electronic Components; Power (Watts): 0.1W, 1/10W; Temperature Coefficient: ±100ppm/°C; Part Number: ERJ-3EKF8200V; Value: 820 Ohms; ComponentLink1Description: Datasheet; ComponentLink1URL: https://industrial.panasonic.com/cdbs/www-data/pdf/RDA0000/AOA0000C304.pdf; ComponentLink2Description: DigiKey Link; ComponentLink2URL: https://www.digikey.com/en/products/detail/panasonic-electronic-components/ERJ-3EKF8200V/1746447; Composition: Thick Film; Device Package: 0603 (1608 Metric); Features: Automotive AEC-Q200; Height - Seated (Max): 0.022" (0.55mm); LastUpdated: 09.02.2024 20:41:57; Lifecycle Status: Active; Minimum Order: 1; Number of Terminations: 2; Operating Temperature: -55°C ~ 155°C; Package / Case: 0603 (1608 Metric); Packaging: TapeAndReel; PartId: 25993; Part Status: Active; Price: 0.01; Ratings: AEC-Q200; Resistance: 820 Ohms; Series: ERJ-3EK; Size / Dimension: 0.063" L x 0.031" W (1.60mm x 0.80mm); Supplier 1: DigiKey; Supplier Part Number 1: P820HCT-ND; Supplier Device Package: 0603; Tolerance: ±1%
S200 = FSM6JSMA: SWITCH TACTILE SPST-NO 0.05A 24V; Manufacturer: TE Connectivity ALCOSWITCH Switches; Actuator Height off PCB, Vertical: 7.00mm; Actuator Orientation: Top Actuated; Actuator Type: Standard; Contact Rating @ Voltage: 0.05A @ 24VDC; Illumination: Non-Illuminated; Operating Force: 160gf; Outline: 6.00mm x 6.00mm; Switch Function: Off-Mom; Part Number: FSM6JSMA; Circuit: SPST-NO; ComponentLink1Description: Datasheet; ComponentLink1URL: https://www.te.com/commerce/DocumentDelivery/DDEController?Action=srchrtrv&DocNm=1308111-1_SWITCHES_CORE_PROGRAM_CATALOG&DocType=CS&DocLang=English; ComponentLink2Description: DigiKey Link; ComponentLink2URL: https://www.digikey.com/en/products/detail/te-connectivity-alcoswitch-switches/FSM6JSMA/525822; LastUpdated: 03.06.2024 20:19:31; Lifecycle Status: Active; Minimum Order: 1; Mounting Type: Surface Mount; Operating Temperature: -35°C ~ 85°C; Packaging: Bulk; Part Status: Active; Price: 0.17; Series: FSMJSMA; Supplier 1: DigiKey; Supplier Part Number 1: 450-1133-ND; Termination Style: Gull Wing
SW200 = CMP-10038-000010-1: SWITCH SLIDE SPDT 300MA 6V; Electrical Life: 5000Cycles; Switch Function: On-On; Actuator Material: Nylon; Actuator Length: 2mm; Actuator Type: Standard; Current Rating: 300mA; Voltage Rating (DC): 6V; Min Operating Temperature: -40°C; Throw Configuration: SPDT; Mount: Surface Mount; Switch Travel: 2mm; Max Operating Temperature: 85°C; Packaging: Cut Tape; Contact Plating: Silver; Contact Material: Copper Alloy
Y200 = ABS07-166-32.768KHZ-T: CRYSTAL 32.7680KHZ 7PF SMD; Manufacturer: Abracon LLC; ESR (Equivalent Series Resistance): 70 kOhms; Frequency Tolerance: ±10ppm; Operating Mode: Fundamental; Part Number: ABS07-166-32.768KHZ-T; ComponentLink1Description: Datasheet; ComponentLink1URL: https://abracon.com/datasheets/ABS07-166-32.768kHz-T.pdf; ComponentLink2Description: DigiKey Link; ComponentLink2URL: https://www.digikey.com/en/products/detail/abracon-llc/ABS07-166-32-768KHZ-T/8827199; Frequency: 32.768 kHz; Height - Seated (Max): 0.035" (0.90mm); LastUpdated: 03.06.2024 20:02:04; Lifecycle Status: Active; Load Capacitance: 7pF; Minimum Order: 1; Mounting Type: Surface Mount; Operating Temperature: -40°C ~ 85°C; Package / Case: 2-SMD, No Lead; Packaging: TapeAndReel; PartId: 384; Part Status: Active; Price: 0.38; Series: ABS07; Size / Dimension: 0.126" L x 0.059" W (3.20mm x 1.50mm); Supplier 1: DigiKey; Supplier Part Number 1: 535-14514-1-ND; Type: kHz Crystal (Tuning Fork); Value: 32.768 kHz
Y201 = NX3225GA-16.000M-STD-CRG-2: CRYSTAL 16.0000MHZ 8PF SMD; Manufacturer: NDK America, Inc.; ESR (Equivalent Series Resistance): 80 Ohms; Frequency Stability: ±30ppm; Frequency Tolerance: ±20ppm; Operating Mode: Fundamental; Part Number: NX3225GA-16.000M-STD-CRG-2; ComponentLink1Description: Datasheet; ComponentLink1URL: http://www.ndk.com/images/products/catalog/c_NX3225GA-STD-CRG-2_e.pdf; ComponentLink2Description: DigiKey Link; ComponentLink2URL: https://www.digikey.com/en/products/detail/ndk-america-inc/NX3225GA-16-000M-STD-CRG-2/3125634; Frequency: 16 MHz; Height - Seated (Max): 0.035" (0.90mm); LastUpdated: 03.06.2024 20:02:19; Lifecycle Status: Active; Load Capacitance: 8pF; Minimum Order: 1; Mounting Type: Surface Mount; Operating Temperature: -40°C ~ 85°C; Package / Case: 4-SMD, No Lead; Packaging: TapeAndReel; PartId: 549; Part Status: Active; Price: 0.33; Series: NX3225GA; Size / Dimension: 0.126" L x 0.098" W (3.20mm x 2.50mm); Supplier 1: DigiKey; Supplier Part Number 1: 644-1175-1-ND; Type: MHz Crystal; Value: 16 MHz